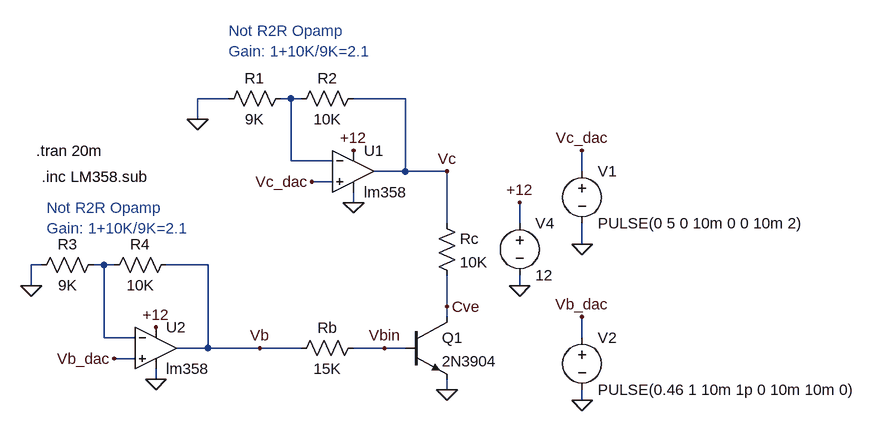
[diagram p0: schematic NPN Configuration.asc]
NPN Configuration.asc, the LTspice schematic file:
Version 4
SHEET 1 1664 804
WIRE 288 -160 240 -160
WIRE 384 -160 368 -160
WIRE 400 -160 384 -160
WIRE 560 -160 480 -160
WIRE 240 -128 240 -160
WIRE 384 -64 384 -160
WIRE 448 -64 384 -64
WIRE 560 -48 560 -160
WIRE 560 -48 512 -48
WIRE 624 -48 560 -48
WIRE 832 -48 832 -80
WIRE 448 -32 416 -32
WIRE 480 0 480 -16
WIRE 624 32 624 -48
WIRE 736 32 736 0
WIRE 832 64 832 32
WIRE 0 96 -16 96
WIRE 96 96 80 96
WIRE 112 96 96 96
WIRE 256 96 192 96
WIRE -16 128 -16 96
WIRE 736 128 736 112
WIRE 624 160 624 112
WIRE 624 176 624 160
WIRE 96 208 96 96
WIRE 144 208 96 208
WIRE 832 208 832 176
WIRE 256 224 256 96
WIRE 256 224 208 224
WIRE 336 224 256 224
WIRE 400 224 336 224
WIRE 528 224 480 224
WIRE 560 224 528 224
WIRE 144 240 112 240
WIRE 176 272 176 256
WIRE 624 288 624 272
WIRE 832 304 832 288
FLAG 624 288 0
FLAG 736 128 0
FLAG 624 160 Cve
FLAG 336 224 Vb
FLAG 736 0 +12
FLAG 832 64 0
FLAG 832 -80 Vc_dac
FLAG 832 304 0
FLAG 832 176 Vb_dac
FLAG 480 0 0
FLAG 176 272 0
FLAG -16 128 0
FLAG 240 -128 0
FLAG 176 192 +12
FLAG 480 -80 +12
FLAG 112 240 Vb_dac
FLAG 416 -32 Vc_dac
FLAG 624 -48 Vc
FLAG 528 224 Vbin
SYMBOL npn 560 176 R0
SYMATTR InstName Q1
SYMATTR Value 2N3904
SYMBOL res 608 16 R0
SYMATTR InstName Rc
SYMATTR Value 10K
SYMBOL voltage 736 16 R0
WINDOW 123 0 0 Left 2
WINDOW 39 0 0 Left 2
SYMATTR InstName V4
SYMATTR Value 12
SYMBOL res 496 208 R90
WINDOW 0 0 56 VBottom 2
WINDOW 3 32 56 VTop 2
SYMATTR InstName Rb
SYMATTR Value 15K
SYMBOL Opamps\\opamp2 480 -112 R0
SYMATTR InstName U1
SYMATTR Value lm358
SYMBOL Opamps\\opamp2 176 160 R0
SYMATTR InstName U2
SYMATTR Value lm358
SYMBOL voltage 832 -64 R0
WINDOW 123 0 0 Left 2
WINDOW 39 0 0 Left 2
SYMATTR InstName V1
SYMATTR Value PULSE(0 5 0 10m 0 0 10m 2)
SYMBOL voltage 832 192 R0
WINDOW 123 0 0 Left 2
WINDOW 39 0 0 Left 2
SYMATTR InstName V2
SYMATTR Value PULSE(0.46 1 10m 1p 0 10m 10m 0)
SYMBOL res 384 -176 R90
WINDOW 0 0 56 VBottom 2
WINDOW 3 32 56 VTop 2
SYMATTR InstName R1
SYMATTR Value 9K
SYMBOL res 496 -176 R90
WINDOW 0 0 56 VBottom 2
WINDOW 3 32 56 VTop 2
SYMATTR InstName R2
SYMATTR Value 10K
SYMBOL res 96 80 R90
WINDOW 0 0 56 VBottom 2
WINDOW 3 32 56 VTop 2
SYMATTR InstName R3
SYMATTR Value 9K
SYMBOL res 208 80 R90
WINDOW 0 0 56 VBottom 2
WINDOW 3 32 56 VTop 2
SYMATTR InstName R4
SYMATTR Value 10K
TEXT -8 -80 Left 2 !.tran 20m
TEXT 0 -40 Left 2 !.inc LM358.sub
TEXT 8 8 Left 2 ;Not R2R Opamp\nGain: 1+10K/9K=2.1
TEXT 288 -264 Left 2 ;Not R2R Opamp\nGain: 1+10K/9K=2.1

The netlist it stands for:
* NPN Configuration.asc
Q1 Cve Vbin 0 0 2N3904
Rc Vc Cve 10K
V4 +12 0 12
Rb Vbin Vb 15K
XU1 Vc_dac N001 +12 0 Vc lm358  ; pins In+ In- V+ V- OUT
XU2 Vb_dac N002 +12 0 Vb lm358  ; pins In+ In- V+ V- OUT
V1 Vc_dac 0 PULSE(0 5 0 10m 0 0 10m 2)
V2 Vb_dac 0 PULSE(0.46 1 10m 1p 0 10m 10m 0)
R1 N001 0 9K
R2 Vc N001 10K
R3 N002 0 9K
R4 Vb N002 10K
.model NPN NPN
.model PNP PNP
.lib standard.bjt
.tran 20m
.inc LM358.sub
* Not R2R Opamp
* Gain: 1+10K/9K=2.1
* Not R2R Opamp
* Gain: 1+10K/9K=2.1
.backanno
.end